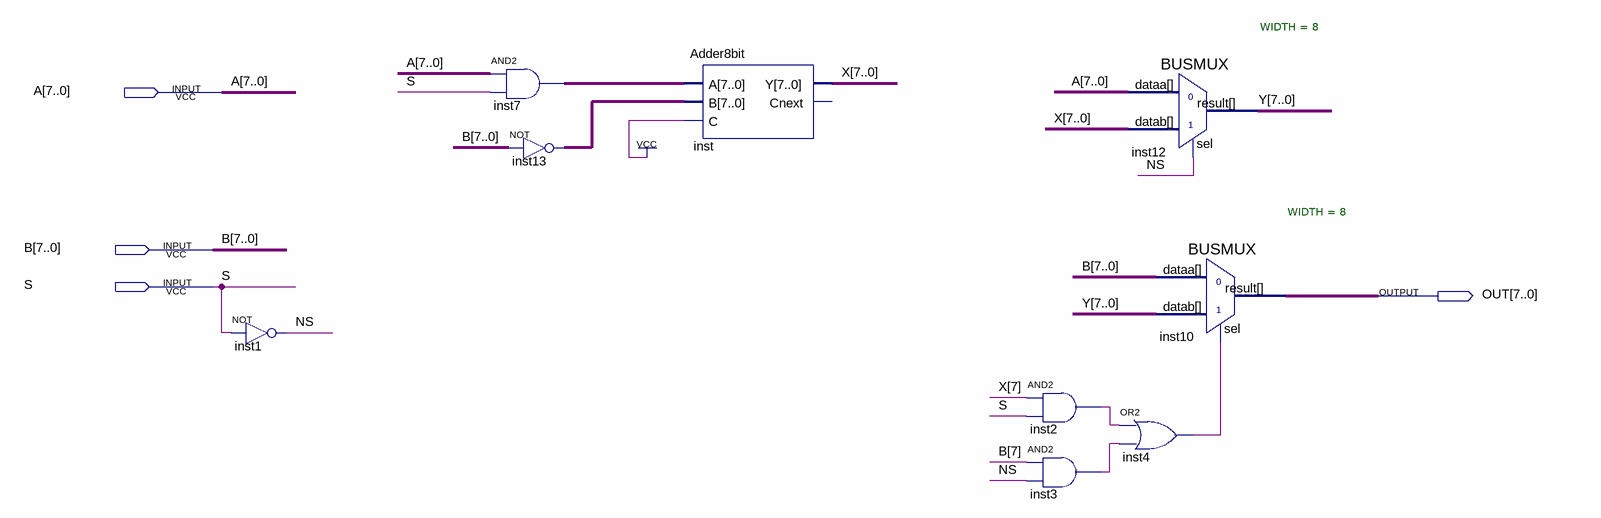
[diagram p0: schematic sheet]
// Quartus schematic AbsMin.bdf as structural Verilog: 9 symbols, 4 pins
module AbsMin (
  input  [7:0] A,
  input  [7:0] B,
  input  S,
  output [7:0] OUT
);

  wire inst2_out, inst3_out, inst4_out, NS;
  wire [7:0] inst7_out, inst13_out, X, Y;

  not inst1 (NS, S);
  assign inst7_out = A & {8{S}};  // AND2 inst7, 8 bits wide
  assign inst13_out = ~B;  // NOT inst13, 8 bits wide
  Adder8bit inst (.A(inst7_out), .B(inst13_out), .C(1'b1), .Y(X));  // open: Cnext
  and inst2 (inst2_out, X[7], S);
  and inst3 (inst3_out, B[7], NS);
  BUSMUX #(.WIDTH(8)) inst12 (.datab(X), .sel(NS), .dataa(A), .result(Y));
  or inst4 (inst4_out, inst2_out, inst3_out);
  BUSMUX #(.WIDTH(8)) inst10 (.datab(Y), .sel(inst4_out), .dataa(B), .result(OUT));
endmodule
